# EAGLE schematic USB2Serial_FT232RL_v1.0 (EAGLE 9.6.2)
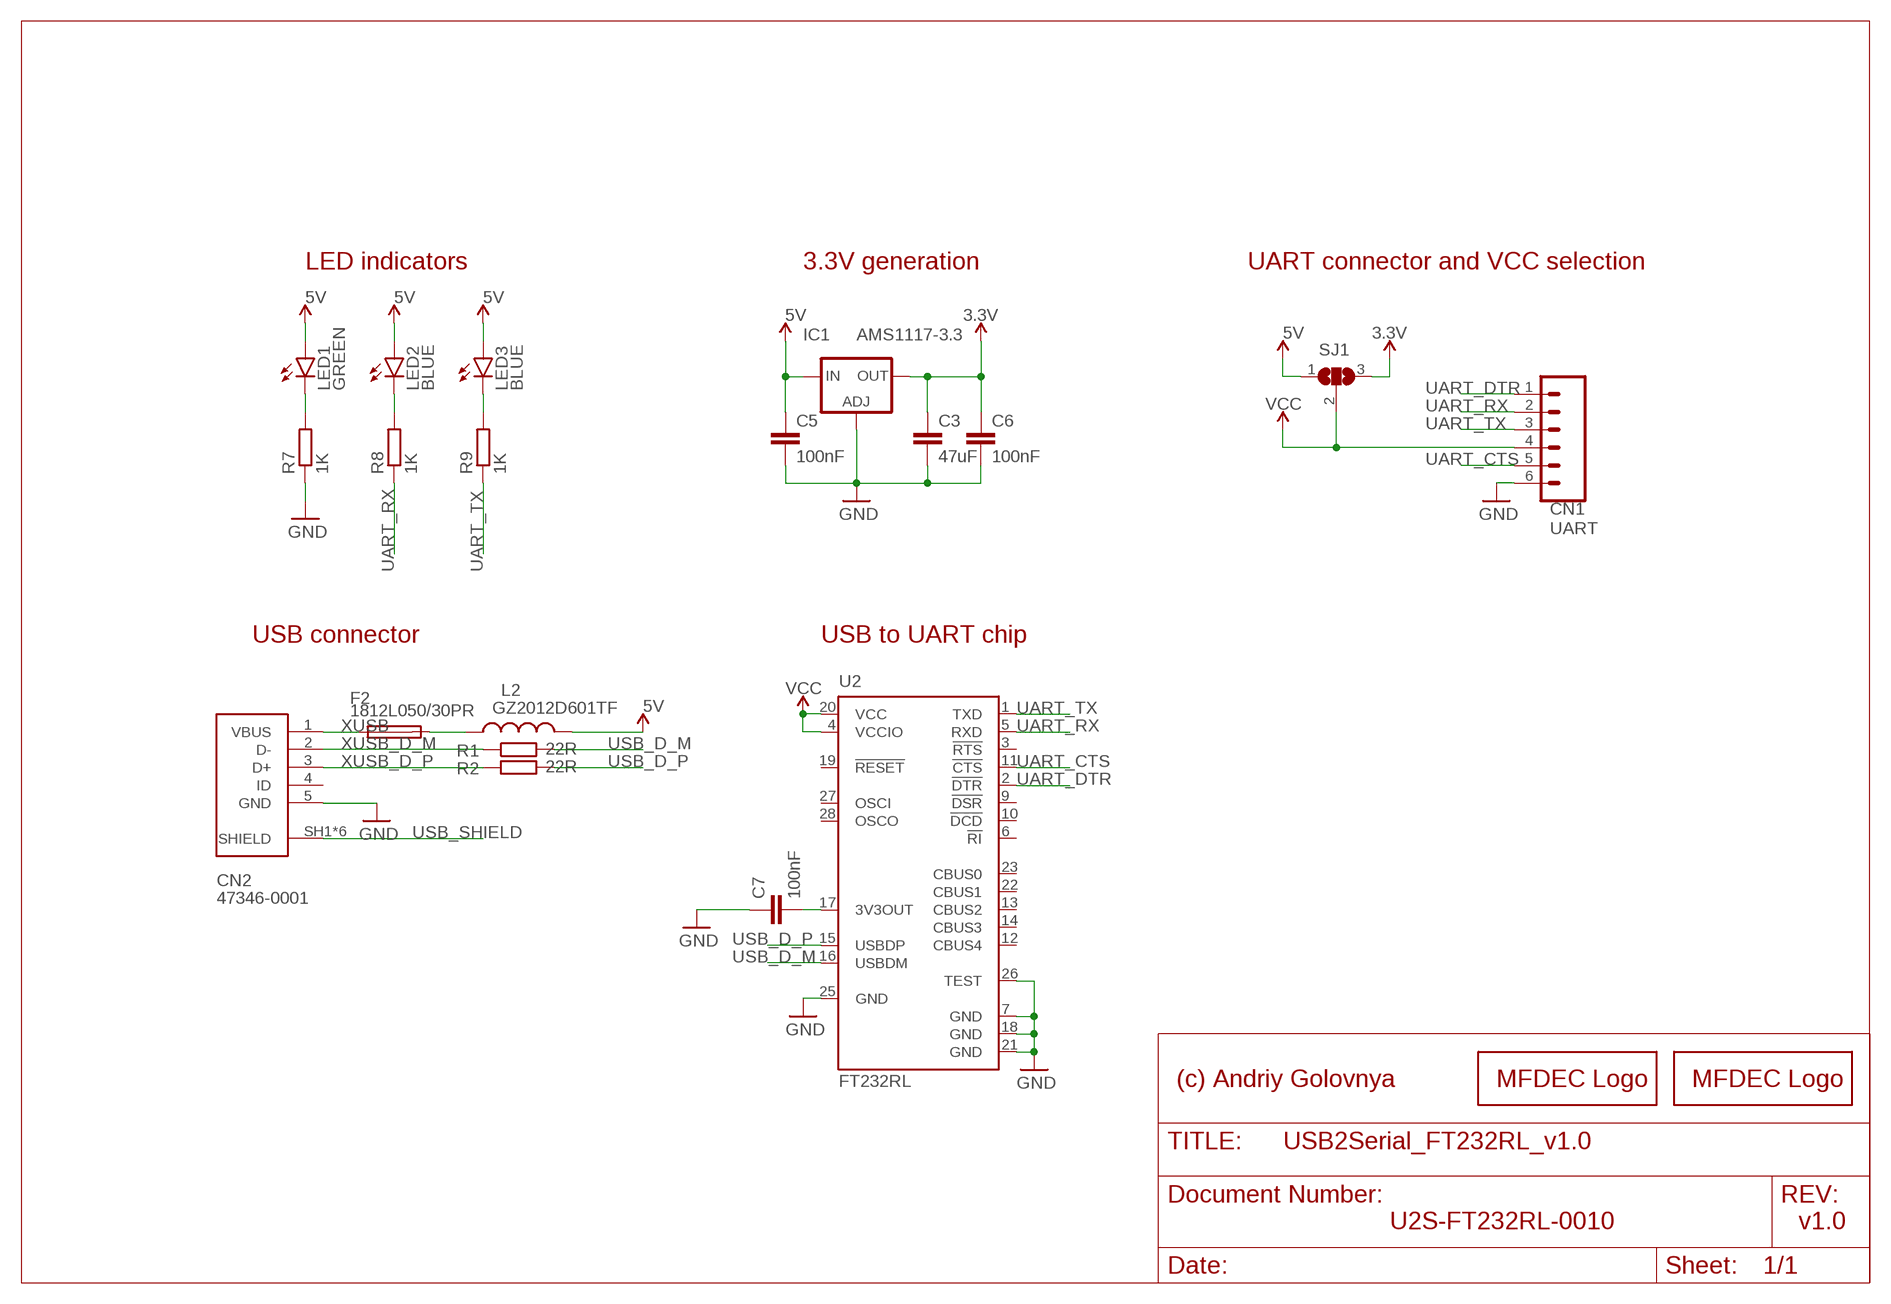
[diagram p0: schematic, sheet 1]

## Parts
C3  47uF  C-EUC0805  [C0805]
C5  100nF  C-EUC0402  [C0402]
C6  100nF  C-EUC0402  [C0402]
C7  100nF  C-EUC0402  [C0402]
CN1  UART  CONN_06LOCK  [1X06_LOCK]
CN2  47346-0001  [MOLEX_47346-0001]
F2  1812L050/30PR  MF-SMDF050  [MF-SMDF050]
IC1  AMS1117-3.3  LD117AS33TR  [SOT223]
L2  GZ2012D601TF  WE-CBA_0805_782853102_HC  [WE-CBA_0805(W=4)]
LED1  GREEN  LEDSML0603  [SML0603]
LED2  BLUE  LEDSML0603  [SML0603]
LED3  BLUE  LEDSML0603  [SML0603]
LOGO1  MFDECLOGO_L_20MM  [MFDEC_L_20MM]
LOGO2  MFDECLOGO_SQ_10MM  [MFDEC_SQ_10MM]
R1  22R  R-EU_R0402  [R0402]
R2  22R  R-EU_R0402  [R0402]
R7  1K  R-EU_R0402  [R0402]
R8  1K  R-EU_R0402  [R0402]
R9  1K  R-EU_R0402  [R0402]
SJ1  SJ2FI  [SJ_2FI]
U2  FT232RL  [SSOP28]

## Nets
3.3V [POWER]: C3.1 C6.1 IC1.4(OUT) SJ1.3
5V [POWER]: C5.1 IC1.3(IN) L2.2 LED1.A LED2.A LED3.A SJ1.1
GND [POWER]: C3.2 C5.2 C6.2 C7.1 CN1.6 CN2.5(GND) IC1.1(ADJ) R7.1 U2.7(GND) U2.18(GND) U2.21(GND) U2.25(GND) U2.26(TEST)
N$4: F2.2 L2.1
N$6: C7.2 U2.17(3V3OUT)
N$7: LED1.C R7.2
N$9: LED3.C R9.2
N$10: LED2.C R8.2
UART_CTS: CN1.5 U2.11(!CTS)
UART_DTR: CN1.1 U2.2(!DTR)
UART_RX: CN1.2 R8.1 U2.5(RXD)
UART_TX: CN1.3 R9.1 U2.1(TXD)
USB_D_M [USB]: R1.2 U2.16(USBDM)
USB_D_P [USB]: R2.2 U2.15(USBDP)
USB_SHIELD: CN2.SH1(SHIELD) CN2.SH2(SHIELD) CN2.SH3(SHIELD) CN2.SH4(SHIELD) CN2.SH5(SHIELD) CN2.SH6(SHIELD)
VCC: CN1.4 SJ1.2 U2.4(VCCIO) U2.20(VCC)
XUSB [POWER]: CN2.1(VBUS) F2.1
XUSB_D_M [XUSB]: CN2.2(D-) R1.1
XUSB_D_P [XUSB]: CN2.3(D+) R2.1
Unconnected: CN2.4(ID) U2.3(!RTS) U2.6(!RI) U2.9(!DSR) U2.10(!DCD) U2.12(CBUS4) U2.13(CBUS2) U2.14(CBUS3) U2.19(!RESET) U2.22(CBUS1) U2.23(CBUS0) U2.27(OSCI) U2.28(OSCO)

## Notes on the sheet
- LED indicators | 3.3V generation | UART connector and VCC selection
- USB connector | USB to UART chip
- (c) Andriy Golovnya
- U2S-FT232RL-0010 | v1.0

## Library data of the parts
C3 C5-C7 = rcl:C-EU: CAPACITOR, European symbol; SPICEPREFIX: C
CN1 = _my_locked_connectors:CONN_06: Multi connection point. Often used as Generic Header-pin footprint for 0.1 inch spaced/style header connections On any of the 0.1 inch spaced packages, you can populate with these: Break Away Headers - Straight <https://www.sparkfun.com/products/116> (PRT-00116) Break Away Male Headers - Right Angle <https://www.sparkfun.com/products/553> (PRT-00553) Female Headers <https://www.sparkfun.com/products/115> (PRT-00115) Break Away Headers - Machine Pin <https://www.sparkfun.com/products/117> (PRT-00117) Break Away Female Headers - Swiss Machine Pin <https://www.sparkfun.com/products/743> (PRT-00743) Arduino Stackable Header - 6 Pin <https://www.sparkfun.com/products/9280> (PRT-09280) For SCREWTERMINALS and SPRING TERMINALS visit here: Screw Terimnals on SparkFun.com <https://www.sparkfun.com/search/results?term=Screw+Terminals> (5mm/3.5mm/2.54mm spacing) This device is also useful as a general connection point to wire up your design to another part of your project. Our various solder wires solder well into these plated through hole pads. Hook-Up Wire - Assortment (Stranded, 22 AWG) <https://www.sparkfun.com/products/11375> (PRT-11375) Hook-Up Wire - Assortment (Solid Core, 22 AWG) <https://www.sparkfun.com/products/11367> (PRT-11367) View the entire wire category on our website here <https://www.sparkfun.com/categories/141>
CN2 = SnapEDA-Library:47346-0001: CONN RCPT 5POS MICRO USB R/A SMD; MANUFACTURER: Molex
F2 = fuse:MF-SMDF: MF-SMDF Series - PRC Resettable Fuses Source: http://www.farnell.com/datasheets/716597.pdf
IC1 = v-reg:LD117A?*: Low drop fixed and adjustable positive voltage regulators 1 A Source: http://www.st.com/stonline/products/literature/ds/7194/ld1117axx.pdf
L2 = Wurth_Automotive_WE-CBA:WE-CBA_0805: WE-CBA SMD EMI Suppression Ferrite Bead Characteristics Reliable Ni-Sn electrodes High rated current up to 5A Recommended soldering: Reflow Operating temperature: -55°C to +125°C Applications * Perfect as data line filter and for uncoupling of distribution voltage *This special SMD chip bead ferrites can be put directly on the printed circuit board. They offer excellent anti-EMI properties and low DC-resistance. Placed very close next to the interference source even with smallest size 0402,maximal impedance at 1000 Ω can be reached. *High Speed: "High Speed " SMD ferrites WE-CBF have lower impedance in the lower frequency ranges thus they have only a low attenuation for fast signals. Application e.g. USB 2.0, IEEE 1394,LVDS *Wide Band: "Wide Band" SMD ferrites WE-CBF already show high impedance in low frequency range. Therefore they are wide band through the whole spectrum. Application e.g. control signats, RS232, RS422, DC/DC converter *High Current: "High Current " SMD ferrites WE-CBF are designed for high current (over 1 A). The rated current refers to 40K self-heating. High current SMD ferrites are available in all there types (High Speed, Wide Band and High Frequency). Application e.g. power supply, DC/DC converter *Advice: Pay attention for the use of SMD-Ferrites for high current>1A and ambient temperature over +85°C that the rated current has to be reduced when temperature is above +85°C (Derating). *At+100°C environment temperature the maximal rated current has to add up to only 60% of the data sheet value ,without an overload of the component. Variant abbreviation WB means WIDE BAND HS means HIGH SPEED HC means HIGH CURRENT <https://katalog.we-online.de/media/images/v2/o14751v209%20Family_WE-CBA.jpg> Details see: https://www.we-online.com/catalog/en/WE-CBA/ Updated by Ella Wu 2019-11-20 2019(C) Wurth Elektronik; DATASHEET-URL: https://www.we-online.com/catalog/datasheet/782853102.pdf; IR1: 1000mA; MOUNT: SMT; PART-NUMBER: 782853102; RDC-MAX: 0.3Ohm; TYPE: High Current; VALUE: 1000Ohm@100MHz; ZMAX: 1000Ohm
LED1-LED3 = led:LED: LED OSRAM: - CHIPLED LG R971, LG N971, LY N971, LG Q971, LY Q971, LO R971, LY R971 LH N974, LH R974 LS Q976, LO Q976, LY Q976 LO Q996 - Hyper CHIPLED LW Q18S LB Q993, LB Q99A, LB R99A - SideLED LS A670, LO A670, LY A670, LG A670, LP A670 LB A673, LV A673, LT A673, LW A673 LH A674 LY A675 LS A676, LA A676, LO A676, LY A676, LW A676 LS A679, LY A679, LG A679 - Hyper Micro SIDELED® LS Y876, LA Y876, LO Y876, LY Y876 LT Y87S - SmartLED LW L88C, LW L88S LB L89C, LB L89S, LG L890 LS L89K, LO L89K, LY L89K LS L896, LA L896, LO L896, LY L896 - TOPLED LS T670, LO T670, LY T670, LG T670, LP T670 LSG T670, LSP T670, LSY T670, LOP T670, LYG T670 LG T671, LOG T671, LSG T671 LB T673, LV T673, LT T673, LW T673 LH T674 LS T676, LA T676, LO T676, LY T676, LB T676, LH T676, LSB T676, LW T676 LB T67C, LV T67C, LT T67C, LS T67K, LO T67K, LY T67K, LW E67C LS E67B, LA E67B, LO E67B, LY E67B, LB E67C, LV E67C, LT E67C LW T67C LS T679, LY T679, LG T679 LS T770, LO T770, LY T770, LG T770, LP T770 LB T773, LV T773, LT T773, LW T773 LH T774 LS E675, LA E675, LY E675, LS T675 LS T776, LA T776, LO T776, LY T776, LB T776 LHGB T686 LT T68C, LB T68C - Hyper Mini TOPLED® LB M676 - Mini TOPLED Santana® LG M470 LS M47K, LO M47K, LY M47K Source: http://www.osram.convergy.de LUXEON: - LUMILED® LXK2-PW12-R00, LXK2-PW12-S00, LXK2-PW14-U00, LXK2-PW14-V00 LXK2-PM12-R00, LXK2-PM12-S00, LXK2-PM14-U00 LXK2-PE12-Q00, LXK2-PE12-R00, LXK2-PE12-S00, LXK2-PE14-T00, LXK2-PE14-U00 LXK2-PB12-K00, LXK2-PB12-L00, LXK2-PB12-M00, LXK2-PB14-N00, LXK2-PB14-P00, LXK2-PB14-Q00 LXK2-PR12-L00, LXK2-PR12-M00, LXK2-PR14-Q00, LXK2-PR14-R00 LXK2-PD12-Q00, LXK2-PD12-R00, LXK2-PD12-S00 LXK2-PH12-R00, LXK2-PH12-S00 LXK2-PL12-P00, LXK2-PL12-Q00, LXK2-PL12-R00 Source: www.luxeon.com KINGBRIGHT: KA-3528ASYC Source: www.kingbright.com
LOGO1 LOGO2 = _my_logos:MFDECLOGO: Midnight Fog - Digital Eye Candy LOGO
R1 R2 R7-R9 = rcl:R-EU_: RESISTOR, European symbol; SPICEPREFIX: R
SJ1 = _my_jumpers:SJ2: SMD solder JUMPER SJ2 - simple jumper SJ2FI - fancy inside jumper SJ2FO - fancy outside jumper SJ2FL - fancy left jumper SJ2FR - fancy right jumper SJ2W - wide jumper
U2 = ftdichip:FT232R: Source: http://www.ftdichip.com/Documents/DataSheets/DS_FT232R_v104.pdf; MPN: FT232RL; OC_FARNELL: 1146032; OC_NEWARK: 91K9918

## Net classes
1 XUSB: width 0.305 mm
2 USB: width 0.305 mm
3 POWER: width 0.305 mm